# EAGLE design hss (EAGLE 7.3.0)
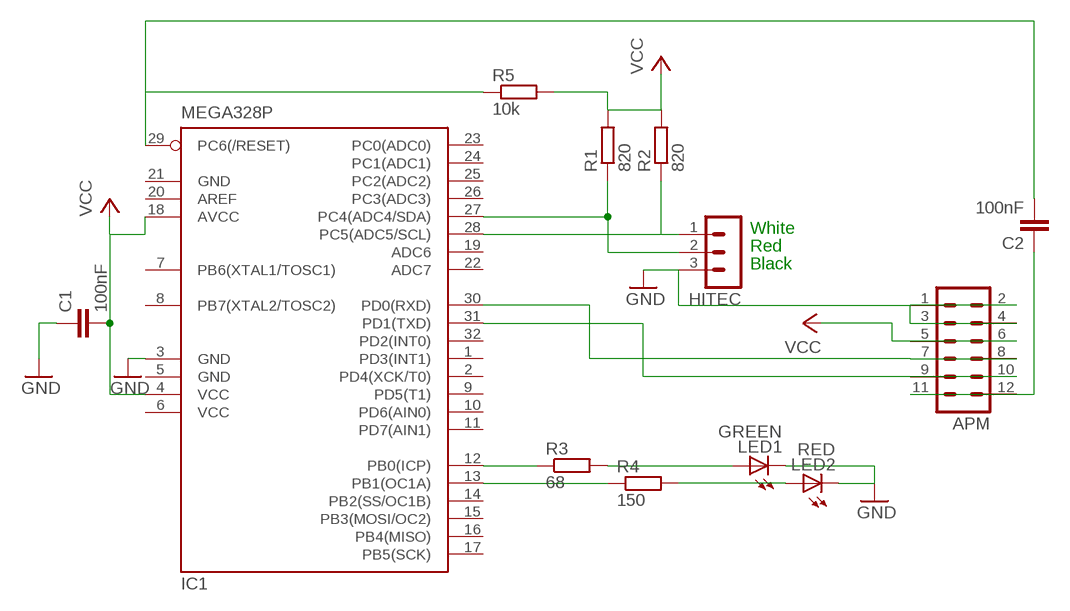
[diagram p0: schematic, sheet 1]

## Parts
APM  MA06-2  [MA06-2]
C1  100nF  C-EUC1206  [C1206]
C2  100nF  C-EUC1206  [C1206]
HITEC  MA03-1  [MA03-1]
IC1  MEGA328P  MEGA8-AI  [TQFP32-08]
LED1  GREEN  LEDSMT1206  [1206]
LED2  RED  LEDSMT1206  [1206]
R1  820  R-EU_M1206  [M1206]
R2  820  R-EU_M1206  [M1206]
R3  68  R-EU_M1206  [M1206]
R4  150  R-EU_M1206  [M1206]
R5  10k  R-EU_M1206  [M1206]

## Nets
GND: APM.1 APM.2 APM.3 APM.4 C1.1 HITEC.3 IC1.3(GND) LED1.C LED2.C
N$1: IC1.12(PB0(ICP)) R3.1
N$3: HITEC.2 IC1.27(PC4(ADC4/SDA)) R1.1
N$4: HITEC.1 IC1.28(PC5(ADC5/SCL)) R2.1
N$5: C2.2 IC1.29(PC6(/RESET)) R5.1
N$7: LED1.A R3.2
N$8: IC1.13(PB1(OC1A)) R4.1
N$9: LED2.A R4.2
N$10: APM.11 APM.12 C2.1
N$14: APM.9 APM.10 IC1.31(PD1(TXD))
N$15: APM.7 APM.8 IC1.30(PD0(RXD))
VCC: APM.5 APM.6 C1.2 IC1.4(VCC) IC1.18(AVCC) R1.2 R2.2 R5.2
Unconnected: IC1.1(PD3(INT1)) IC1.2(PD4(XCK/T0)) IC1.7(PB6(XTAL1/TOSC1)) IC1.8(PB7(XTAL2/TOSC2)) IC1.9(PD5(T1)) IC1.10(PD6(AIN0)) IC1.11(PD7(AIN1)) IC1.14(PB2(SS/OC1B)) IC1.15(PB3(MOSI/OC2)) IC1.16(PB4(MISO)) IC1.17(PB5(SCK)) IC1.19(ADC6) IC1.20(AREF) IC1.22(ADC7) IC1.23(PC0(ADC0)) IC1.24(PC1(ADC1)) IC1.25(PC2(ADC2)) IC1.26(PC3(ADC3)) IC1.32(PD2(INT0))

## Notes on the sheet
- White
- Red
- Black

## Power pins joined to a net without a drawn wire
GND: IC1.5(GND) IC1.21(GND)
VCC: IC1.6(VCC)

## Library data of the parts
APM = con-lstb:MA06-2: PIN HEADER; OC_FARNELL: unknown; OC_NEWARK: unknown
C1 C2 = resistor:C-EU: CAPACITOR, European symbol
HITEC = con-lstb:MA03-1: PIN HEADER; OC_FARNELL: unknown; OC_NEWARK: unknown
IC1 = atmel:MEGA8: MICROCONTROLLER 8 Kbytes FLASH, 1 kbytes SRAM, 512 bytes EEPROM, USART, 6-channel 10 bit ADC, 2-channel 8 bit ADC Pin compatible with Atmega48, ATMega88, ATMega168 Source: avr.lbr; MPN: ATMEGA8-16AU; OC_FARNELL: 9171371; OC_NEWARK: 73M8863
LED1 LED2 = led:LED: LED OSRAM: - CHIPLED LG R971, LG N971, LY N971, LG Q971, LY Q971, LO R971, LY R971 LH N974, LH R974 LS Q976, LO Q976, LY Q976 LO Q996 - Hyper CHIPLED LW Q18S LB Q993, LB Q99A, LB R99A - SideLED LS A670, LO A670, LY A670, LG A670, LP A670 LB A673, LV A673, LT A673, LW A673 LH A674 LY A675 LS A676, LA A676, LO A676, LY A676, LW A676 LS A679, LY A679, LG A679 - Hyper Micro SIDELED® LS Y876, LA Y876, LO Y876, LY Y876 LT Y87S - SmartLED LW L88C, LW L88S LB L89C, LB L89S, LG L890 LS L89K, LO L89K, LY L89K LS L896, LA L896, LO L896, LY L896 - TOPLED LS T670, LO T670, LY T670, LG T670, LP T670 LSG T670, LSP T670, LSY T670, LOP T670, LYG T670 LG T671, LOG T671, LSG T671 LB T673, LV T673, LT T673, LW T673 LH T674 LS T676, LA T676, LO T676, LY T676, LB T676, LH T676, LSB T676, LW T676 LB T67C, LV T67C, LT T67C, LS T67K, LO T67K, LY T67K, LW E67C LS E67B, LA E67B, LO E67B, LY E67B, LB E67C, LV E67C, LT E67C LW T67C LS T679, LY T679, LG T679 LS T770, LO T770, LY T770, LG T770, LP T770 LB T773, LV T773, LT T773, LW T773 LH T774 LS E675, LA E675, LY E675, LS T675 LS T776, LA T776, LO T776, LY T776, LB T776 LHGB T686 LT T68C, LB T68C - Hyper Mini TOPLED® LB M676 - Mini TOPLED Santana® LG M470 LS M47K, LO M47K, LY M47K Source: http://www.osram.convergy.de LUXEON: - LUMILED® LXK2-PW12-R00, LXK2-PW12-S00, LXK2-PW14-U00, LXK2-PW14-V00 LXK2-PM12-R00, LXK2-PM12-S00, LXK2-PM14-U00 LXK2-PE12-Q00, LXK2-PE12-R00, LXK2-PE12-S00, LXK2-PE14-T00, LXK2-PE14-U00 LXK2-PB12-K00, LXK2-PB12-L00, LXK2-PB12-M00, LXK2-PB14-N00, LXK2-PB14-P00, LXK2-PB14-Q00 LXK2-PR12-L00, LXK2-PR12-M00, LXK2-PR14-Q00, LXK2-PR14-R00 LXK2-PD12-Q00, LXK2-PD12-R00, LXK2-PD12-S00 LXK2-PH12-R00, LXK2-PH12-S00 LXK2-PL12-P00, LXK2-PL12-Q00, LXK2-PL12-R00 Source: www.luxeon.com KINGBRIGHT: KA-3528ASYC Source: www.kingbright.com
R1-R5 = resistor:R-EU_: RESISTOR, European symbol

## Board
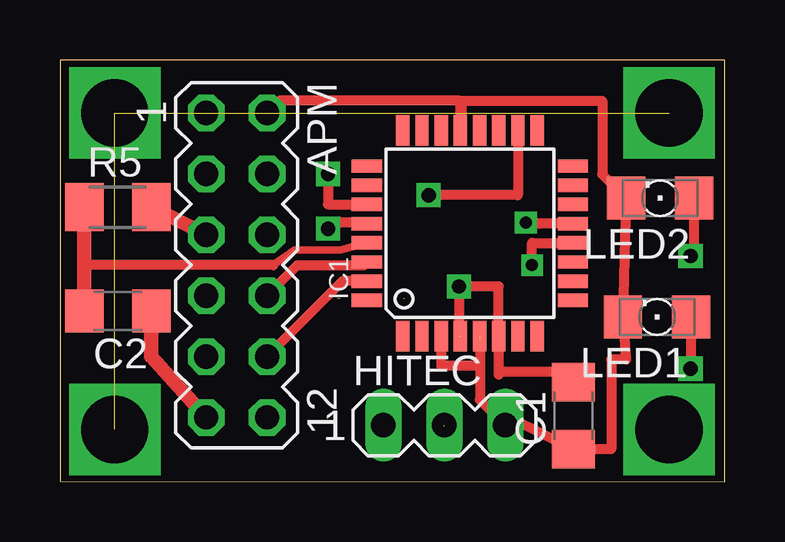
[diagram p1: board, top side]
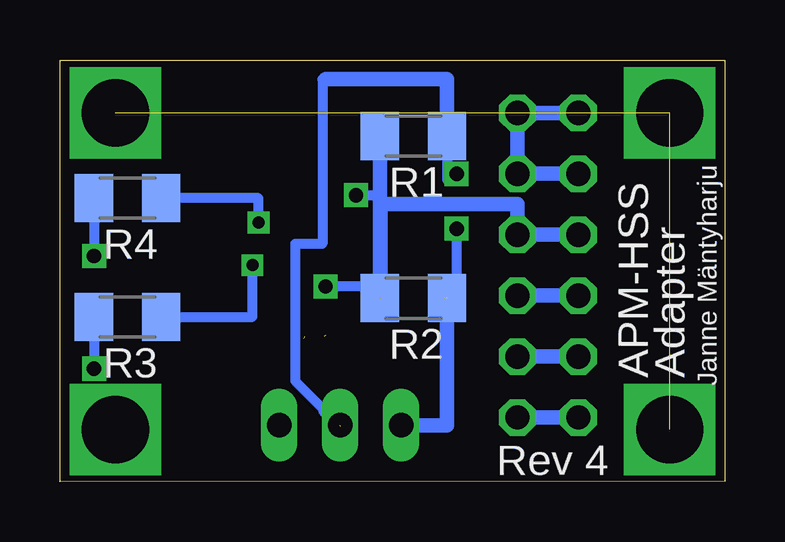
[diagram p2: board, bottom side, seen from below]

Size 27.71 x 17.59 mm. Coordinates in mm from the lower left corner, seen from the top.
Outline: 0,0.02 27.71,0 27.71,17.59 0,17.59 0,0.02
Copper layers (1*16): Top 0.035mm / dielectric 1.5mm / Bottom 0.035mm
Design rules "default": minimum track width 10mil, minimum drill 24mil, track to track 8mil, track to pad 8mil, pad to pad 8mil, via to via 8mil, smd to smd 8mil, copper to edge 40mil, drill to drill 8mil, minimum pad ring 10mil, minimum via ring 8mil, stop-mask expansion 4mil, vias tented up to drill 0mil, thermal gap 10mil

### Footprints (pad centres in the part's own frame; a part is rotated, then mirrored left to right if it is on the bottom)
MA06-2 = drill 1.016 octagon: 1 -6.35,-1.27; 2 -6.35,1.27; 3 -3.81,-1.27; 4 -3.81,1.27; 5 -1.27,-1.27; 6 -1.27,1.27; 7 1.27,-1.27; 8 1.27,1.27; 9 3.81,-1.27; 10 3.81,1.27; 11 6.35,-1.27; 12 6.35,1.27
C1206 = smd 1.6 x 1.8: 1 -1.4,0; 2 1.4,0
MA03-1 = drill 1.016 long: 1 -2.54,0; 2 0,0; 3 2.54,0
TQFP32-08 = smd 1.27 x 0.559: 1 -4.293,2.8; 2 -4.293,2; 3 -4.293,1.2; 4 -4.293,0.4; 5 -4.293,-0.4; 6 -4.293,-1.2; 7 -4.293,-2; 8 -4.293,-2.8; 17 4.293,-2.8; 18 4.293,-2; 19 4.293,-1.2; 20 4.293,-0.4; 21 4.293,0.4; 22 4.293,1.2; 23 4.293,2; 24 4.293,2.8 | smd 0.559 x 1.27: 9 -2.8,-4.293; 10 -2,-4.293; 11 -1.2,-4.293; 12 -0.4,-4.293; 13 0.4,-4.293; 14 1.2,-4.293; 15 2,-4.293; 16 2.8,-4.293; 25 2.8,4.293; 26 2,4.293; 27 1.2,4.293; 28 0.4,4.293; 29 -0.4,4.293; 30 -1.2,4.293; 31 -2,4.293; 32 -2.8,4.293
1206 = smd 1.6 x 1.803: A -1.422,0; C 1.422,0
M1206 = smd 1.6 x 2: 1 -1.4,0; 2 1.4,0

### Placement (x,y rotation side)
APM  7.37,9.03 270 top
C1  21.4,2.76 90 top
C2  2.41,7.13 180 top
HITEC  16.02,2.36 0 top
IC1  17.09,10.36 90 top
LED1  24.89,6.87 180 top
LED2  25.02,11.83 180 top
R1  12.97,14.41 180 bottom
R2  12.97,7.66 180 bottom
R3  24.89,6.87 180 bottom
R4  24.89,11.83 180 bottom
R5  2.41,11.45 0 top

### Tracks (layer width: path | path; a pad name or v marks a point on that pad's centre or on a via)
GND  (1 unrouted)
  Top 0.406: APM.2 9.14,15.89 16.69,15.89 IC1.21 16.76,14.66 16.76,15.89 22.61,15.89 22.61,12.82 LED2.C LED1.C 23.6,5.1 22.99,5.1 22.99,1.36 C1.1 18.82,2.61 HITEC.3 17.49,3.43 17.53,3.43 17.53,4.84 | IC1.3 15.89,4.84 17.53,4.84 | 17.53,4.84 17.53,5.98
  Bottom 0.61: APM.1 APM.2 APM.4 APM.3
N$1  (via drill 0.5 pad 0.61)
  Top 0.406: v19.68,9.03 19.68,9.96 IC1.12
  Bottom 0.406: R3.1 19.68,6.87 v19.68,9.03
N$3  (via drill 0.6)  (1 unrouted)
  Top 0.406: v11.18,12.84 11.18,11.56 IC1.27
  Bottom 0.406: R1.1 11.57,12.59 v11.18,12.84 | 16.64,16.78 16.76,16.78 16.76,9.92 17.91,9.92 17.91,4.21 16,2.3
  Bottom 0.61: HITEC.2 16.64,2.97 | 16.64,16.78 11.57,16.78 R1.1
N$4  (via drill 0.6)  (1 unrouted)
  Top 0.406: IC1.28 12.8,10.81 11.18,10.81 v11.18,10.56
  Bottom 0.406: v11.18,10.56 11.18,7.76 11.68,7.76 11.68,7.64
  Bottom 0.61: HITEC.1 11.57,2.36 R2.1
N$5
  Top 0.305: IC1.29 11.68,9.67 9.78,9.67 8.89,9.03
  Top 0.406: 8.89,9.03 1.01,9.03
  Top 0.61: R5.1 1.01,9.03 C2.2
N$7  (via drill 0.6)
  Top 0.406: v26.29,4.71 26.31,4.71 LED1.A
  Bottom 0.406: R3.2 v26.29,4.71
N$8  (via drill 0.5 pad 0.61)
  Top 0.406: IC1.13 19.99,10.76 v19.43,10.81
  Bottom 0.406: v19.43,10.81 19.43,11.83 R4.1
N$9  (via drill 0.6)
  Top 0.406: v26.29,9.41 26.44,9.41 LED2.A
  Bottom 0.406: R4.2 v26.29,9.41
N$10
  Top 0.61: APM.11 3.81,5.22 C2.1
  Bottom 0.61: APM.11 APM.12
N$11  (via drill 2.8 pad 2.54)  (2 unrouted)
  other vias: 25.4,15.38 2.29,15.38 2.29,2.17
N$12  (via drill 2.8 pad 2.54)
  other vias: 25.4,2.17
N$14
  Top 0.406: IC1.31 11.78,8.36 APM.10
  Bottom 0.61: APM.9 APM.10
N$15
  Top 0.406: APM.8 9.91,9.03 12.67,9.03 IC1.30
  Bottom 0.61: APM.7 APM.8
VCC  (via drill 0.6)  (2 unrouted)
  Top 0.406: IC1.18 19.09,11.95 v15.37,11.95 | 16.76,6.11 16.64,6.11 v16.64,8.14 18.29,8.14 IC1.6 18.29,4.59 | 18.29,4.46 18.29,4.59 | C1.2 21.4,4.59 18.29,4.59
  Top 0.61: APM.5 R5.2
  Bottom 0.406: v15.37,11.95 14.37,11.95 | R2.2 14.37,8.14 v16.64,8.14
  Bottom 0.61: APM.5 APM.6 8.64,11.57 14.35,11.57 14.35,7.64 | R2.2 14.37,11.95 R1.2

### Text on the board
bNames: Janne Mäntyharju | Adapter | APM-HSS | Rev 4